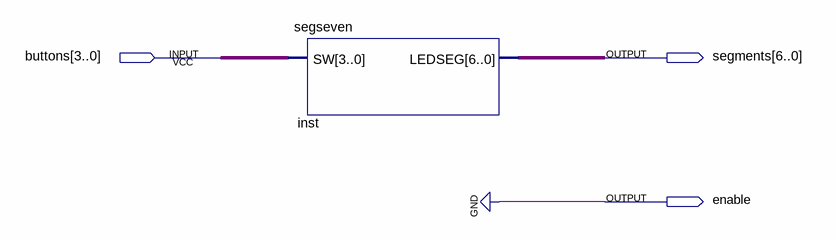
[diagram p0: schematic sheet]
// Quartus schematic test.bdf as structural Verilog: 1 symbols, 3 pins
module test (
  input  [3:0] buttons,
  output [6:0] segments,
  output enable
);

  segseven inst (.SW(buttons), .LEDSEG(segments));

  assign enable = 1'b0;
endmodule
